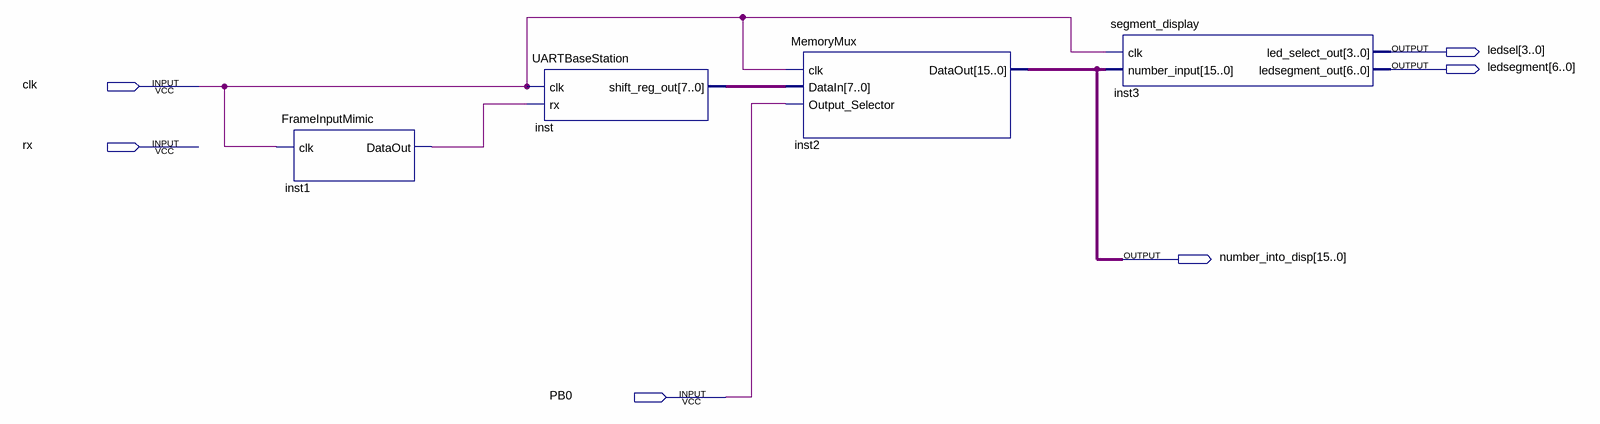
[diagram p0: schematic sheet]
// Quartus schematic FullVHDL.bdf as structural Verilog: 4 symbols, 6 pins
module FullVHDL (
  input  clk,
  input  rx,
  input  PB0,
  output [3:0] ledsel,
  output [6:0] ledsegment,
  output [15:0] number_into_disp
);

  wire inst1_dataout;
  wire [7:0] inst_shift_reg_out;

  FrameInputMimic inst1 (.clk(clk), .DataOut(inst1_dataout));
  UARTBaseStation inst (.clk(clk), .rx(inst1_dataout), .shift_reg_out(inst_shift_reg_out));
  MemoryMux inst2 (.clk(clk), .DataIn(inst_shift_reg_out), .Output_Selector(PB0), .DataOut(number_into_disp));
  segment_display inst3 (
    .clk(clk), .number_input(number_into_disp), .led_select_out(ledsel), .ledsegment_out(ledsegment));
endmodule
